# EAGLE design Kompass_ControlFramePTH (EAGLE 9.3.1)
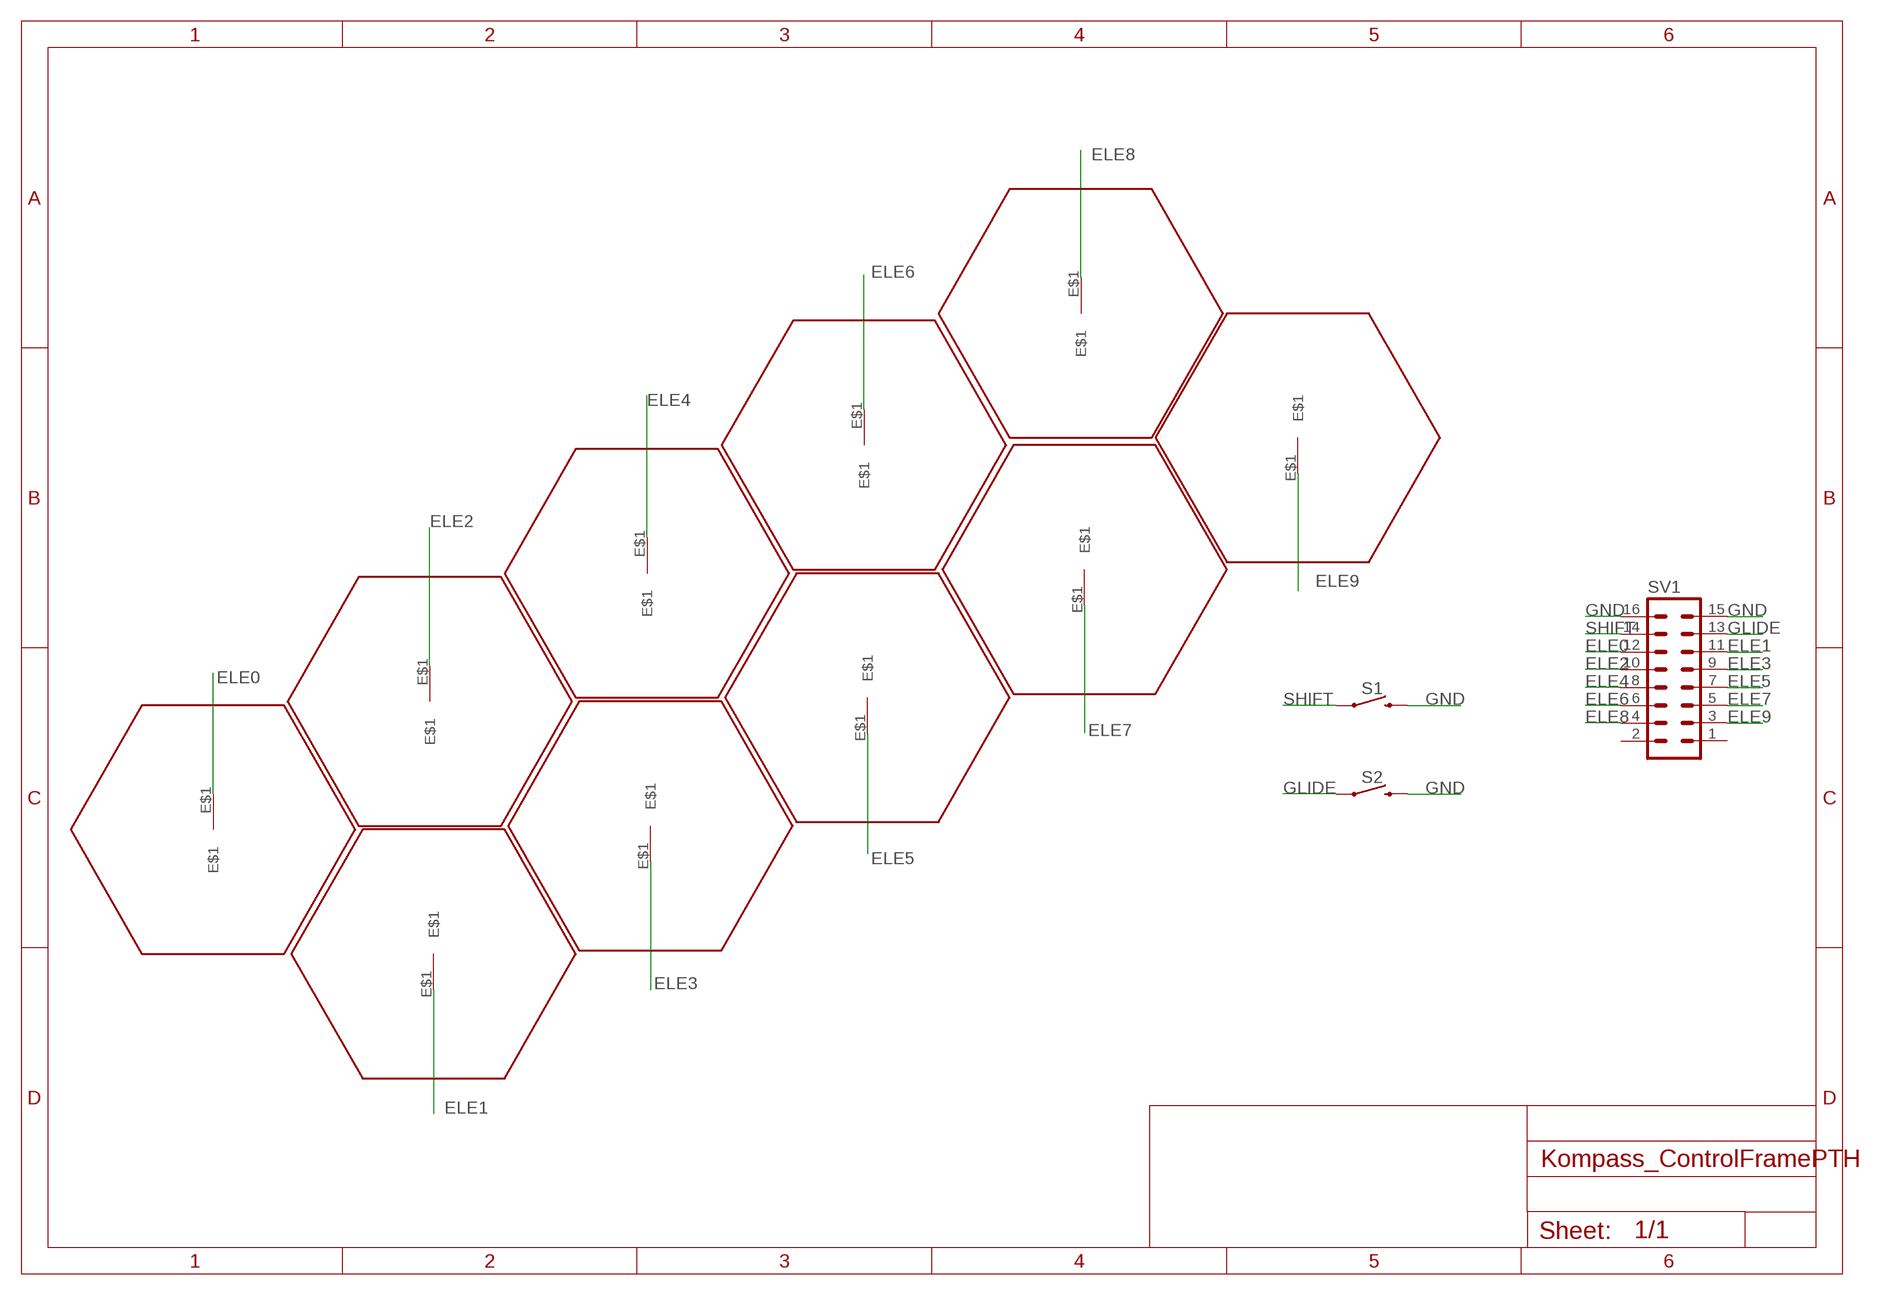
[diagram p0: schematic, sheet 1]

## Parts
ELE0  HEX_ELECTRODEHEX_ELECTRODEPAD  [HEX_ELECTRODE]
ELE1  HEX_ELECTRODEHEX_ELECTRODEPAD  [HEX_ELECTRODE]
ELE2  HEX_ELECTRODEHEX_ELECTRODEPAD  [HEX_ELECTRODE]
ELE3  HEX_ELECTRODEHEX_ELECTRODEPAD  [HEX_ELECTRODE]
ELE4  HEX_ELECTRODEHEX_ELECTRODEPAD  [HEX_ELECTRODE]
ELE5  HEX_ELECTRODEHEX_ELECTRODEPAD  [HEX_ELECTRODE]
ELE6  HEX_ELECTRODEHEX_ELECTRODEPAD  [HEX_ELECTRODE]
ELE7  HEX_ELECTRODEHEX_ELECTRODEPAD  [HEX_ELECTRODE]
ELE8  HEX_ELECTRODEHEX_ELECTRODEPAD  [HEX_ELECTRODE]
ELE9  HEX_ELECTRODEHEX_ELECTRODEPAD  [HEX_ELECTRODE]
S1  MOMENTARY-SWITCH-SPST-PTH-6.0MM-KIT  [TACTILE_SWITCH_PTH_6.0MM_KIT]
S2  MOMENTARY-SWITCH-SPST-PTH-6.0MM-KIT  [TACTILE_SWITCH_PTH_6.0MM_KIT]
SV1  MA08-2  [MA08-2]

## Nets
ELE0: ELE0.E$1 SV1.12
ELE1: ELE1.E$1 SV1.11
ELE2: ELE2.E$1 SV1.10
ELE3: ELE3.E$1 SV1.9
ELE4: ELE4.E$1 SV1.8
ELE5: ELE5.E$1 SV1.7
ELE6: ELE6.E$1 SV1.6
ELE7: ELE7.E$1 SV1.5
ELE8: ELE8.E$1 SV1.4
ELE9: ELE9.E$1 SV1.3
GLIDE: S2.1 SV1.13
GND: S1.3 S2.3 SV1.15 SV1.16
SHIFT: S1.1 SV1.14
Unconnected: SV1.1 SV1.2

## Library data of the parts
ELE0 ELE1-ELE9 = BOCUMA_HEX_ELECTRODE:HEX_ELECTRODE
S1 S2 = SparkFun-Switches:MOMENTARY-SWITCH-SPST: Momentary Switch (Pushbutton) - SPST Normally-open (NO) SPST momentary switches (buttons, pushbuttons). Variants PTH-12MM - 12mm square, through-hole Momentary Pushbutton Switch - 12mm Square <https://www.sparkfun.com/products/9190> (COM-09190) PTH-6.0MM, PTH-6.0MM-KIT - 6.0mm square, through-hole Mini Pushbutton Switch <https://www.sparkfun.com/products/97> (COM-00097) KIT package intended for soldering kit's - only one side of pads' copper is exposed. PTH-RIGHT-ANGLE-KIT - Right-angle, through-hole Right Angle Tactile Button <https://www.sparkfun.com/products/10791> - Used on SparkFun BigTime Watch Kit <https://www.sparkfun.com/products/11734> SMD-12MM - 12mm square, surface-mount Tactile Button - SMD (12mm) <https://www.sparkfun.com/products/12993> (COM-12993) Used on SparkFun PicoBoard <https://www.sparkfun.com/products/11888> SMD-4.5MM - 4.5mm Square Trackball Switch Used on SparkFun Blackberry Trackballer Breakout <https://www.sparkfun.com/products/13169> SMD-4.6MMX2.8MM - 4.60mm x 2.80mm, surface mount Used on SparkFun SAMD21 Mini Breakout <https://www.sparkfun.com/products/13664> SMD-5.2MM, SMD-5.2-REDUNDANT - 5.2mm square, surface-mount Mini Pushbutton Switch - SMD <https://www.sparkfun.com/products/8720> (COM-08720) Used on Arduino Pro Mini <https://www.sparkfun.com/products/11114> REDUNDANT package connects both switch circuits together SMD-6.0X3.5MM - 6.0 x 3.5mm, surface mount Momentary Reset Switch SMD <https://www.sparkfun.com/products/8229> (COM-08229) SMD-6.2MM-TALL - 6.2mm square, surface mount Tactile Button - SMD (6mm) <https://www.sparkfun.com/products/12992> Used on SparkFun Digital Sandbox <https://www.sparkfun.com/products/12651> SMD-RIGHT-ANGLE - Right-angle, surface mount Used on SparkFun Block for Intel® Edison - Arduino <https://www.sparkfun.com/products/13036>; PROD_ID: SWCH-08441; SF_SKU: COM-00097
SV1 = con-lstb:MA08-2: PIN HEADER; OC_FARNELL: unknown; OC_NEWARK: unknown

## Board
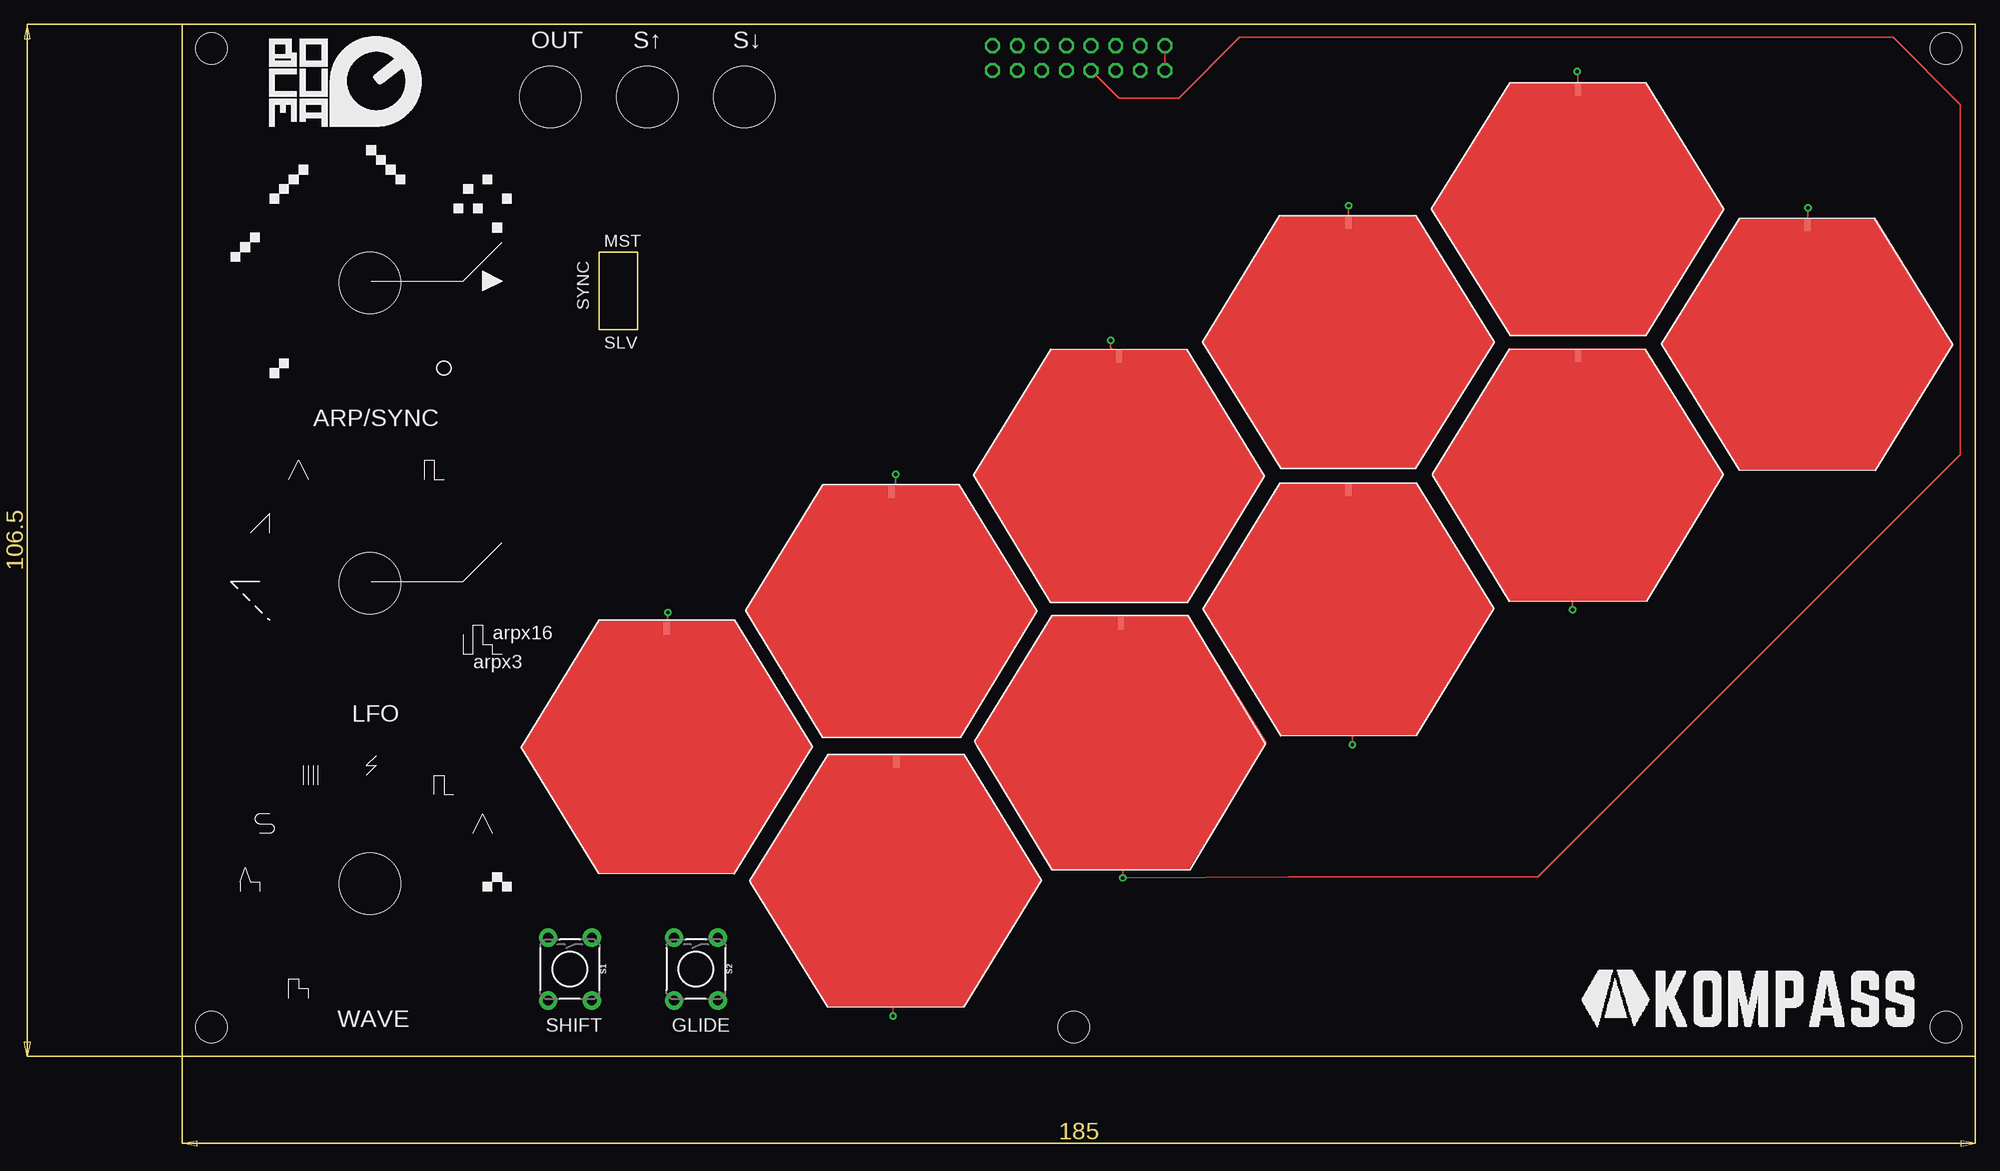
[diagram p1: board, top side]
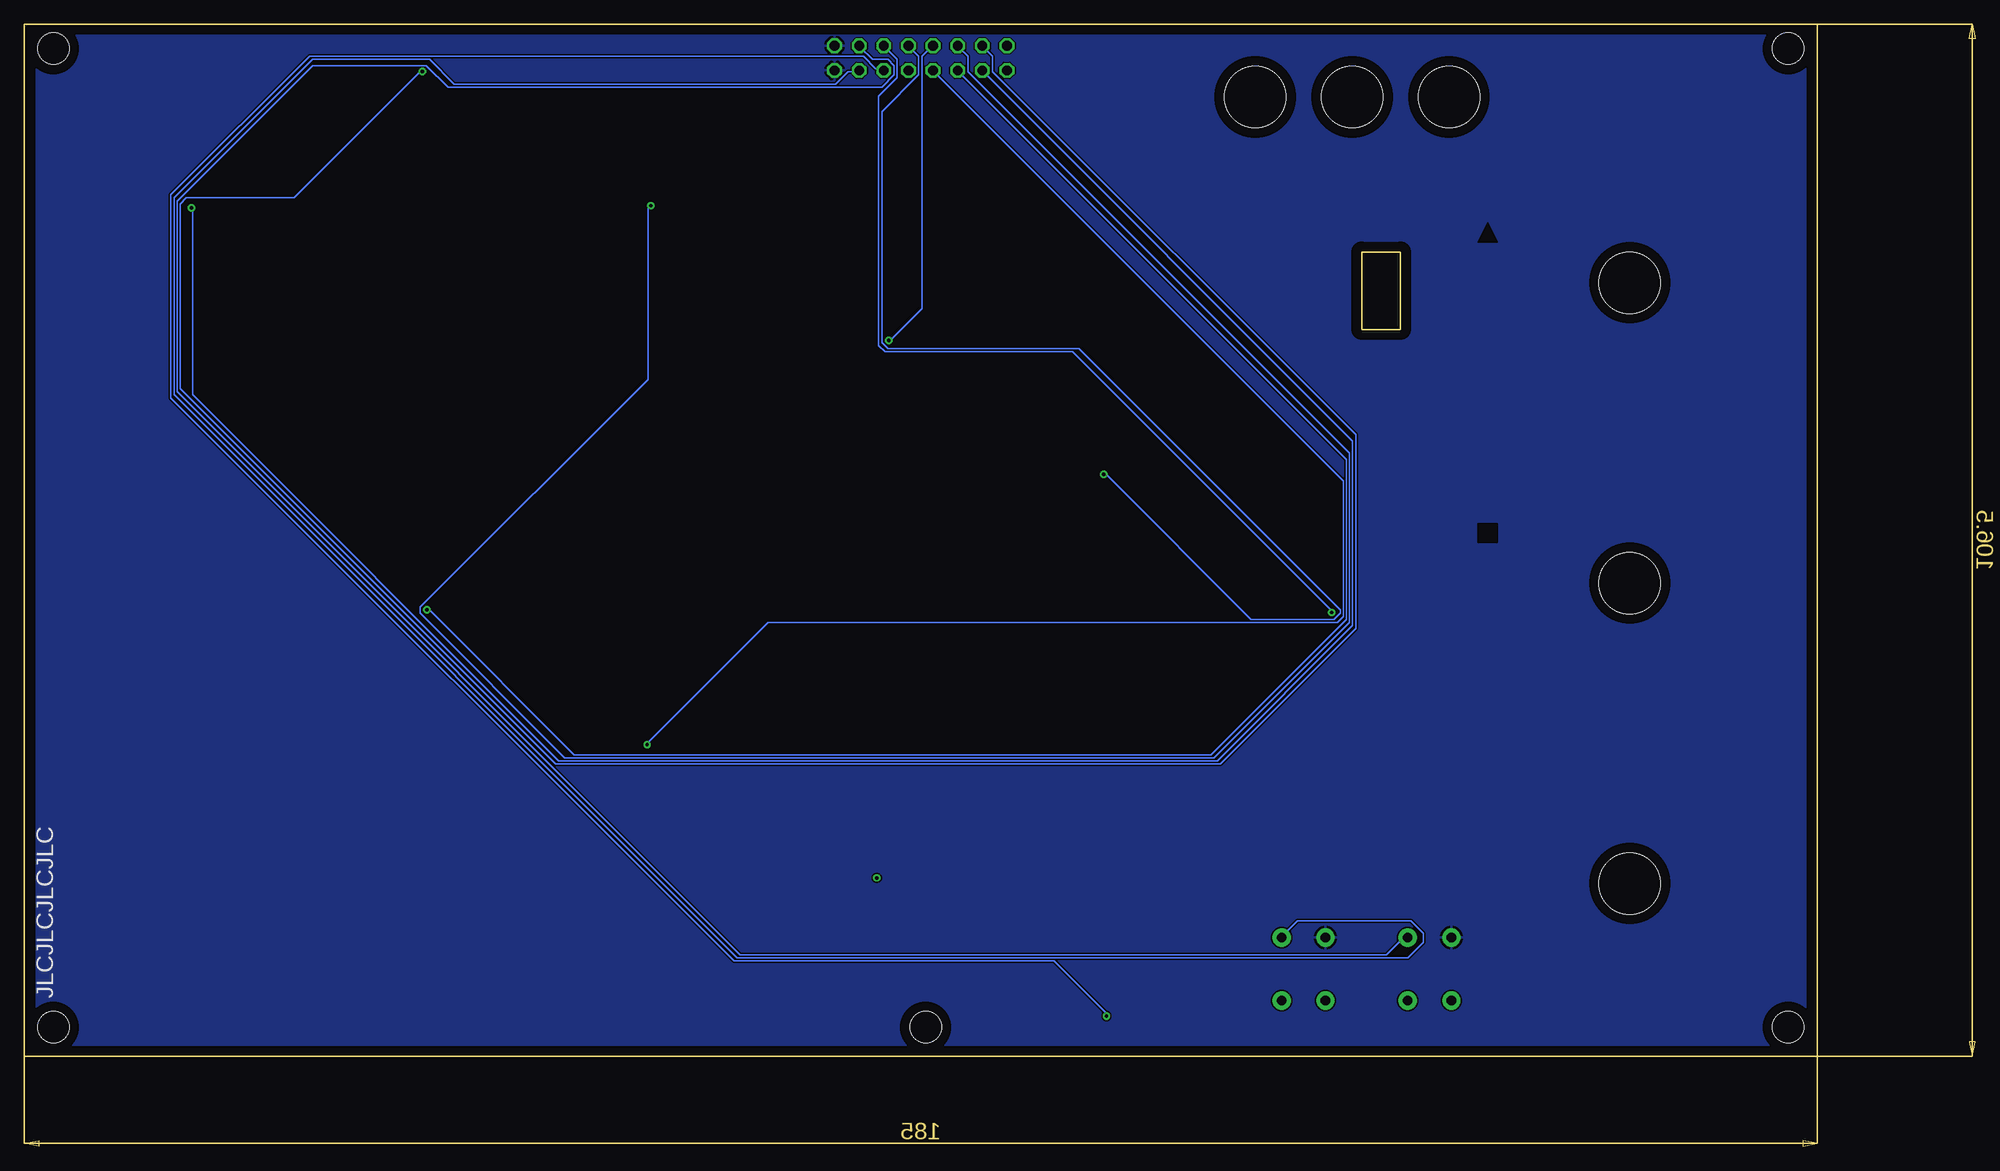
[diagram p2: board, bottom side, seen from below]

Size 185 x 106.5 mm. Coordinates in mm from the lower left corner, seen from the top.
Outline: 43,83 43,75 47,75 47,83 43,83
Outline: 0,0 0,106.5 185,106.5 185,0 0,0
Copper layers (1*16): Top 0.035mm / dielectric 1.5mm / Bottom 0.035mm
Design rules "default": minimum track width 6mil, minimum drill 0.35mm, track to track 6mil, track to pad 6mil, pad to pad 6mil, via to via 6mil, smd to smd 6mil, copper to edge 40mil, drill to drill 6mil, minimum pad ring 10mil, minimum via ring 8mil, stop-mask expansion 4mil, vias tented up to drill 0mil, thermal gap 10mil
Holes 6.35 mm at 19.35,17.83 19.35,48.83 19.35,79.83 38,99 48,99 58,99
Holes 3.25 mm at 3,104 3,3 92,3 182,3 182,104
tRestrict: area 33,53 to 35,55; area 33,84 to 35,86
bRestrict: area 33,53 to 35,55; area 33,84 to 35,86
vRestrict: area 33,53 to 35,55; area 33,84 to 35,86

### Footprints (pad centres in the part's own frame; a part is rotated, then mirrored left to right if it is on the bottom)
HEX_ELECTRODE = smd 0.635 x 1.27: E$1 0,12.319
TACTILE_SWITCH_PTH_6.0MM_KIT = drill 1.016 pad 1.88: 1 -3.251,2.261; 2 3.251,2.261; 3 -3.251,-2.261; 4 3.251,-2.261
MA08-2 = drill 1.016 octagon: 1 -8.89,-1.27; 2 -8.89,1.27; 3 -6.35,-1.27; 4 -6.35,1.27; 5 -3.81,-1.27; 6 -3.81,1.27; 7 -1.27,-1.27; 8 -1.27,1.27; 9 1.27,-1.27; 10 1.27,1.27; 11 3.81,-1.27; 12 3.81,1.27; 13 6.35,-1.27; 14 6.35,1.27; 15 8.89,-1.27; 16 8.89,1.27

### Placement (x,y rotation side)
ELE0  50,31.86 0 top
ELE1  73.67,18.12 0 top
ELE2  73.17,45.91 0 top
ELE3  96.84,32.36 0 top
ELE4  96.65,59.92 0 top
ELE5  120.32,46.14 0 top
ELE6  120.32,73.7 0 top
ELE7  143.99,59.96 0 top
ELE8  143.99,87.44 0 top
ELE9  167.66,73.47 0 top
S1  40,9 270 top
S2  53,9 270 top
SV1  92.5,103 0 top

### Tracks (layer width: path | path; a pad name or v marks a point on that pad's centre or on a via)
ELE0  (via drill 0.35)
  Top 0.152: ELE0.E$1 50.1,44.28 v50.1,45.8
  Bottom 0.152: v50.1,45.8 50.16,46.04 76.83,72.71 96.2,72.71 96.84,73.34 96.84,99.06 94.93,100.97 94.93,102.87 96.2,104.14 SV1.12
ELE1  (via drill 0.35)
  Top 0.152: ELE1.E$1 v73.34,4.15
  Bottom 0.152: v73.34,4.15 73.34,4.45 78.74,9.84 111.76,9.84 169.86,67.94 169.86,88.9 155.57,103.19 98.42,103.19 97.16,101.92 96.52,101.92 SV1.11
ELE2  (via drill 0.35)
  Top 0.152: ELE2.E$1 73.61,58.67 v73.61,60.05
  Bottom 0.152: v73.61,60.05 73.34,60.01 58.42,45.09 49.85,45.09 49.21,45.72 49.21,46.04 76.2,73.03 95.89,73.03 96.52,73.66 96.52,97.47 92.71,101.28 92.71,103.19 93.66,104.14 SV1.10
ELE3  (via drill 0.35)
  Top 0.152: ELE3.E$1 v97.04,18.4 114.11,18.52 139.87,18.52 183.45,62.1 183.45,98.21 176.53,105.14 109.08,105.14 102.78,98.84 102.77,98.85 96.65,98.85 SV1.9
ELE4  (via drill 0.35)
  Top 0.152: ELE4.E$1 95.78,73.11 v95.78,73.88
  Bottom 0.152: v95.78,73.88 95.57,73.98 92.39,77.15 92.39,103.19 91.79,103.79 91.44,104.14 91.31,104.27 SV1.8
ELE5  (via drill 0.35)
  Top 0.152: ELE5.E$1 v120.74,32.16
  Bottom 0.152: v120.74,32.16 120.65,32.38 108.27,44.77 49.53,44.77 48.9,45.4 48.9,59.37 91.12,101.6 SV1.7
ELE6  (via drill 0.35)
  Top 0.152: ELE6.E$1 120.32,87.75 v120.36,87.78
  Bottom 0.152: v120.36,87.78 120.65,87.63 120.65,69.85 144.15,46.35 144.15,45.72 129.22,30.8 62.23,30.8 48.26,44.77 48.26,62.23 87.63,101.6 87.63,103.19 88.58,104.14 SV1.6
ELE7  (via drill 0.35)
  Top 0.152: ELE7.E$1 v143.45,46.06
  Bottom 0.152: v143.45,46.06 143.19,46.04 128.27,31.11 62.55,31.11 48.58,45.09 48.58,61.59 88.58,101.6 SV1.5
ELE8  (via drill 0.35)
  Top 0.152: ELE8.E$1 143.99,101.53 v143.9,101.61
  Bottom 0.152: v143.9,101.61 144.15,101.6 157.16,88.58 168.28,88.58 168.91,87.95 168.91,68.9 130.18,30.16 61.59,30.16 47.62,44.13 47.62,64.14 85.09,101.6 85.09,103.19 86.04,104.14 SV1.4
ELE9  (via drill 0.35)
  Top 0.152: ELE9.E$1 v167.75,87.55
  Bottom 0.152: v167.75,87.55 167.64,87.31 167.64,68.26 129.86,30.48 61.91,30.48 47.94,44.45 47.94,63.5 86.15,101.71 SV1.3
GLIDE
  Bottom 0.152: SV1.13 99.06,101.6 100.01,101.6 101.28,100.33 140.65,100.33 143.19,102.87 155.26,102.87 169.54,88.58 169.54,68.26 111.44,10.16 42.23,10.16 40.64,11.75 40.64,12.7 41.91,13.97 53.66,13.97 55.24,12.38 S2.1
GND
  Top 0.152: SV1.15 SV1.16
  pour Bottom: 0.99,105.84 0.99,0.88 1.22,0.65 184.18,0.65 184.44,0.91 184.44,105.54 183.87,106.11 1.3,106.11 0.99,106.11
SHIFT
  Bottom 0.152: SV1.14 98.74,104.14 97.47,102.87 95.89,102.87 95.25,102.23 95.25,101.28 96.52,100.01 141.29,100.01 143.51,102.23 155.26,102.23 169.23,88.27 169.23,68.58 111.12,10.48 44.45,10.48 42.55,12.38 S1.1

### Text on the board
tNames: OUT | S↑ | S↓ | MST | SYNC | SLV | ARP/SYNC | arpx16 | arpx3 | LFO | WAVE | SHIFT | GLIDE
bNames: JLCJLCJLCJLC